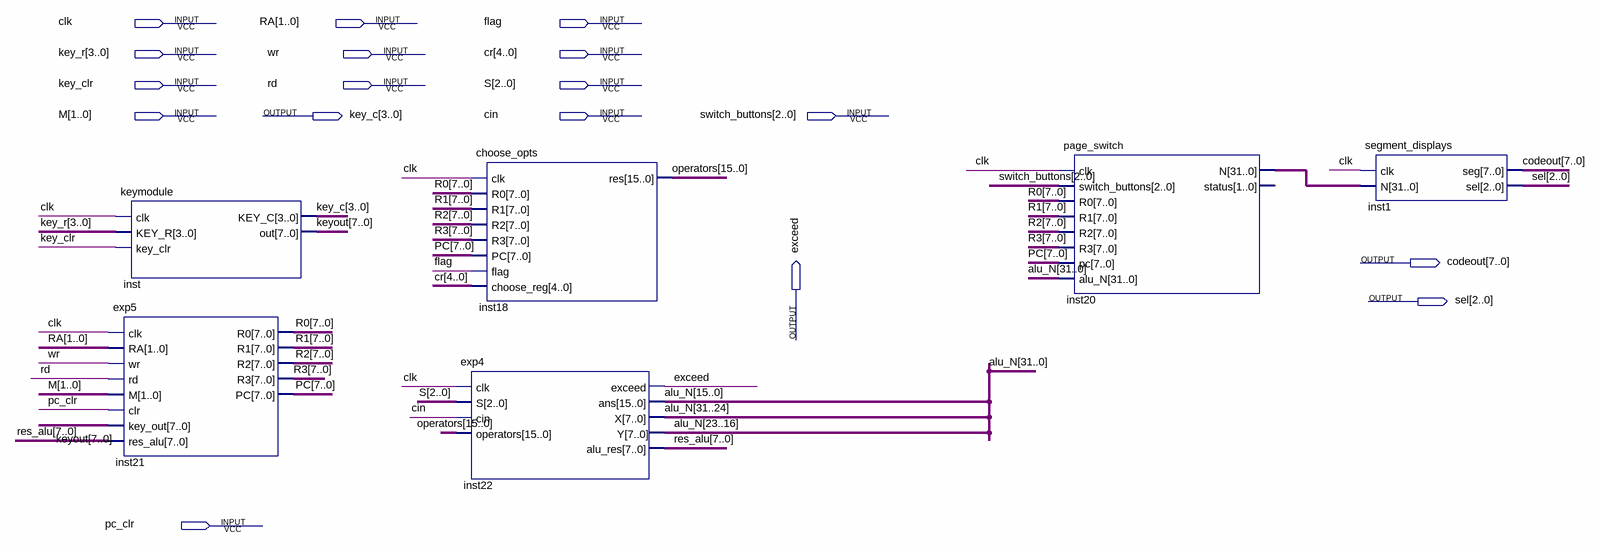
[diagram p0: schematic sheet]
// Quartus schematic exp6.bdf as structural Verilog: 6 symbols, 17 pins
module exp6 (
  input  clk,
  input  [1:0] RA,
  input  flag,
  input  [3:0] key_r,
  input  wr,
  input  [4:0] cr,
  input  key_clr,
  input  rd,
  input  [2:0] S,
  input  [1:0] M,
  input  cin,
  input  [2:0] switch_buttons,
  input  pc_clr,
  output [3:0] key_c,
  output [7:0] codeout,
  output [2:0] sel,
  output exceed
);

  wire [7:0] keyout, PC, R0, R1, R2, R3, res_alu;
  wire [15:0] operators;
  wire [31:0] alu_N, inst20_n;

  exp5 inst21 (
    .clk(clk), .RA(RA), .wr(wr), .rd(rd), .M(M), .clr(pc_clr), .key_out(keyout), .res_alu(res_alu), .R0(R0),
    .R1(R1), .R2(R2), .R3(R3), .PC(PC));
  keymodule inst (.clk(clk), .KEY_R(key_r), .key_clr(key_clr), .KEY_C(key_c), .out(keyout));
  choose_opts inst18 (
    .clk(clk), .R0(R0), .R1(R1), .R2(R2), .R3(R3), .PC(PC), .flag(flag), .choose_reg(cr), .res(operators));
  exp4 inst22 (
    .clk(clk), .S(S), .cin(cin), .operators(operators), .exceed(exceed), .ans(alu_N[15:0]), .X(alu_N[31:24]),
    .Y(alu_N[23:16]), .alu_res(res_alu));
  page_switch inst20 (
    .clk(clk), .switch_buttons(switch_buttons), .R0(R0), .R1(R1), .R2(R2), .R3(R3), .pc(PC), .alu_N(alu_N),
    .N(inst20_n));  // open: status
  segment_displays inst1 (.clk(clk), .N(inst20_n), .seg(codeout), .sel(sel));
endmodule
